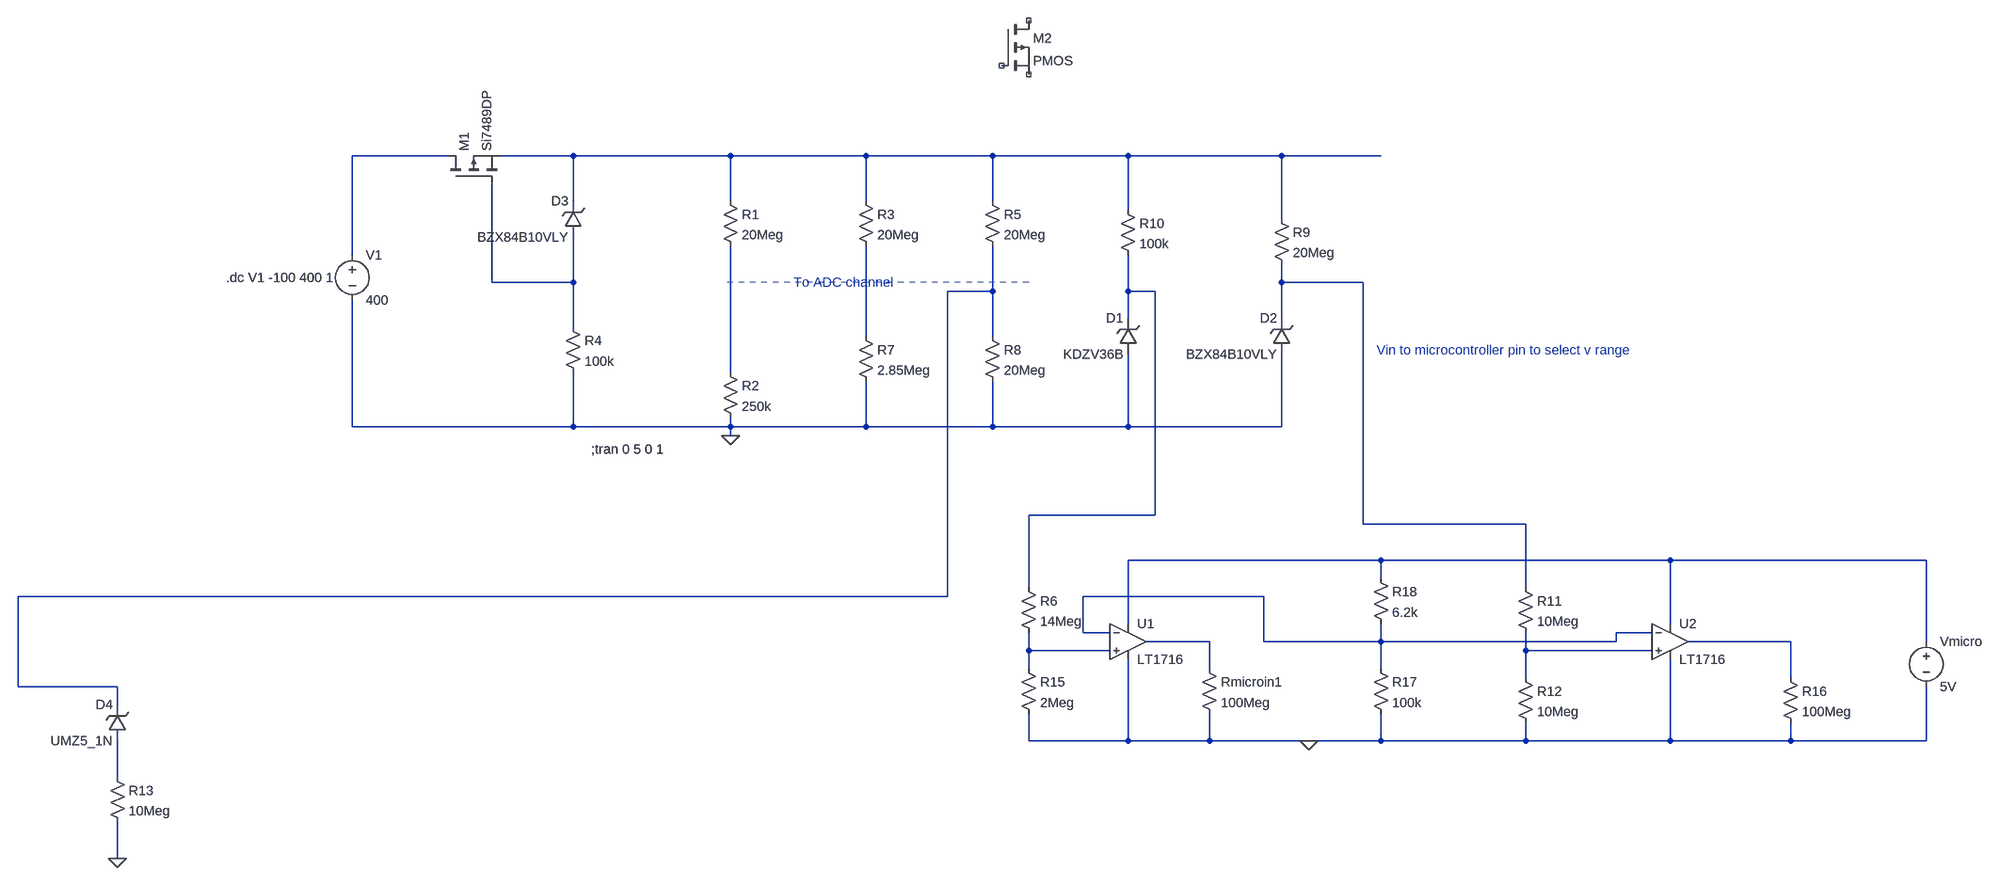
[diagram p0: schematic Voltmeter with range select.asc]
Voltmeter with range select.asc, the LTspice schematic file:
Version 4
SHEET 1 2620 1252
WIRE -288 -48 -480 -48
WIRE -64 -48 -192 -48
WIRE 288 -48 -64 -48
WIRE 528 -48 288 -48
WIRE 752 -48 528 -48
WIRE 992 -48 752 -48
WIRE 1264 -48 992 -48
WIRE 1440 -48 1264 -48
WIRE -64 32 -64 -48
WIRE 288 32 288 -48
WIRE 528 32 528 -48
WIRE 752 32 752 -48
WIRE 992 48 992 -48
WIRE 1264 64 1264 -48
WIRE -480 128 -480 -48
WIRE -208 176 -208 0
WIRE -64 176 -64 96
WIRE -64 176 -208 176
WIRE 1264 176 1264 144
WIRE 1408 176 1264 176
WIRE 752 192 752 112
WIRE 752 192 672 192
WIRE 992 192 992 128
WIRE 1040 192 992 192
WIRE 992 240 992 192
WIRE 1264 240 1264 176
WIRE -64 256 -64 176
WIRE 528 272 528 112
WIRE 752 272 752 192
WIRE 288 336 288 112
WIRE -480 432 -480 208
WIRE -64 432 -64 336
WIRE -64 432 -480 432
WIRE 288 432 288 416
WIRE 288 432 -64 432
WIRE 528 432 528 352
WIRE 528 432 288 432
WIRE 752 432 752 352
WIRE 752 432 528 432
WIRE 992 432 992 304
WIRE 992 432 752 432
WIRE 1264 432 1264 304
WIRE 1264 432 992 432
WIRE 288 448 288 432
WIRE 1040 624 1040 192
WIRE 1040 624 816 624
WIRE 1408 640 1408 176
WIRE 1696 640 1408 640
WIRE 1440 704 992 704
WIRE 1952 704 1440 704
WIRE 2512 704 1952 704
WIRE 1440 736 1440 704
WIRE 816 752 816 624
WIRE 1696 752 1696 640
WIRE 672 768 672 192
WIRE 672 768 -1072 768
WIRE 1232 768 912 768
WIRE 992 816 992 704
WIRE 1952 816 1952 704
WIRE 912 832 912 768
WIRE 960 832 912 832
WIRE 1920 832 1856 832
WIRE 1136 848 1024 848
WIRE 1232 848 1232 768
WIRE 1440 848 1440 816
WIRE 1440 848 1232 848
WIRE 1856 848 1856 832
WIRE 1856 848 1440 848
WIRE 2192 848 1984 848
WIRE 2512 848 2512 704
WIRE 816 864 816 832
WIRE 960 864 816 864
WIRE 1696 864 1696 832
WIRE 1920 864 1696 864
WIRE 816 896 816 864
WIRE 1136 896 1136 848
WIRE 1440 896 1440 848
WIRE 1696 912 1696 864
WIRE 2192 912 2192 848
WIRE -1072 928 -1072 768
WIRE -896 928 -1072 928
WIRE -896 960 -896 928
WIRE 816 1024 816 976
WIRE 992 1024 992 880
WIRE 992 1024 816 1024
WIRE 1136 1024 1136 976
WIRE 1136 1024 992 1024
WIRE 1312 1024 1136 1024
WIRE 1440 1024 1440 976
WIRE 1440 1024 1312 1024
WIRE 1696 1024 1696 992
WIRE 1696 1024 1440 1024
WIRE 1952 1024 1952 880
WIRE 1952 1024 1696 1024
WIRE 2192 1024 2192 992
WIRE 2192 1024 1952 1024
WIRE 2512 1024 2512 928
WIRE 2512 1024 2192 1024
WIRE -896 1088 -896 1024
WIRE -896 1232 -896 1168
FLAG 288 448 0
FLAG 1312 1024 0
FLAG -896 1232 0
SYMBOL voltage -480 112 R0
WINDOW 123 0 0 Left 0
WINDOW 39 0 0 Left 0
SYMATTR InstName V1
SYMATTR Value 400
SYMBOL res 272 16 R0
SYMATTR InstName R1
SYMATTR Value 20Meg
SYMBOL res 272 320 R0
SYMATTR InstName R2
SYMATTR Value 250k
SYMBOL res 512 16 R0
SYMATTR InstName R3
SYMATTR Value 20Meg
SYMBOL res 736 16 R0
SYMATTR InstName R5
SYMATTR Value 20Meg
SYMBOL res 512 256 R0
SYMATTR InstName R7
SYMATTR Value 2.85Meg
SYMBOL res 736 256 R0
SYMATTR InstName R8
SYMATTR Value 20Meg
SYMBOL zener 1008 304 R180
WINDOW 0 24 64 Left 2
WINDOW 3 24 0 Left 2
SYMATTR InstName D1
SYMATTR Value KDZV36B
SYMBOL zener 1280 304 R180
WINDOW 0 24 64 Left 2
WINDOW 3 24 0 Left 2
SYMATTR InstName D2
SYMATTR Value BZX84B10VLY
SYMBOL res 1248 48 R0
SYMATTR InstName R9
SYMATTR Value 20Meg
SYMBOL res 976 32 R0
SYMATTR InstName R10
SYMATTR Value 100k
SYMBOL pmos 768 -288 R0
SYMATTR InstName M2
SYMBOL voltage 2512 832 R0
WINDOW 123 0 0 Left 0
WINDOW 39 0 0 Left 0
SYMATTR InstName Vmicro
SYMATTR Value 5V
SYMBOL res 800 736 R0
SYMATTR InstName R6
SYMATTR Value 14Meg
SYMBOL res 800 880 R0
SYMATTR InstName R15
SYMATTR Value 2Meg
SYMBOL res 1120 880 R0
SYMATTR InstName Rmicroin1
SYMATTR Value 100Meg
SYMBOL res 1424 880 R0
SYMATTR InstName R17
SYMATTR Value 100k
SYMBOL res 1424 720 R0
SYMATTR InstName R18
SYMATTR Value 6.2k
SYMBOL Comparators\\LT1716 992 848 R0
SYMATTR InstName U1
SYMBOL pmos -288 0 R270
SYMATTR InstName M1
SYMATTR Value Si7489DP
SYMBOL zener -48 96 R180
WINDOW 0 24 64 Left 2
WINDOW 3 24 0 Left 2
SYMATTR InstName D3
SYMATTR Value BZX84B10VLY
SYMBOL res -80 240 R0
SYMATTR InstName R4
SYMATTR Value 100k
SYMBOL res 1680 736 R0
SYMATTR InstName R11
SYMATTR Value 10Meg
SYMBOL res 1680 896 R0
SYMATTR InstName R12
SYMATTR Value 10Meg
SYMBOL Comparators\\LT1716 1952 848 R0
SYMATTR InstName U2
SYMBOL res 2176 896 R0
SYMATTR InstName R16
SYMATTR Value 100Meg
SYMBOL zener -880 1024 R180
WINDOW 0 24 64 Left 2
WINDOW 3 24 0 Left 2
SYMATTR InstName D4
SYMATTR Value UMZ5_1N
SYMBOL res -912 1072 R0
SYMATTR InstName R13
SYMATTR Value 10Meg
TEXT -32 472 Left 2 !;tran 0 5 0 1
TEXT 1432 296 Left 2 ;Vin to microcontroller pin to select v range
TEXT 400 176 Left 2 ;To ADC channel
TEXT -704 168 Left 2 !.dc V1 -100 400 1
LINE Normal 816 176 272 176 2

The netlist it stands for:
* Voltmeter with range select.asc
V1 N001 0 400
R1 N002 N008 20Meg
R2 N008 0 250k
R3 N002 N007 20Meg
R5 N002 N005 20Meg
R7 N007 0 2.85Meg
R8 N005 0 20Meg
D1 0 N006 KDZV36B
D2 0 N004 BZX84B10VLY
R9 N002 N004 20Meg
R10 N002 N006 100k
M2 NC_01 NC_02 NC_03 NC_03 PMOS
Vmicro N009 0 5V
R6 N006 N013 14Meg
R15 N013 0 2Meg
Rmicroin1 N011 0 100Meg
R17 N010 0 100k
R18 N009 N010 6.2k
XU1 N013 N010 N009 0 N011 LT1716  ; pins In+ In- V+ V- OUT
M1 N001 N003 N002 N002 Si7489DP
D3 N003 N002 BZX84B10VLY
R4 N003 0 100k
R11 N004 N014 10Meg
R12 N014 0 10Meg
XU2 N014 N010 N009 0 N012 LT1716  ; pins In+ In- V+ V- OUT
R16 N012 0 100Meg
D4 N015 N005 UMZ5_1N
R13 N015 0 10Meg
.model D D
.lib standard.dio
.model NMOS NMOS
.model PMOS PMOS
.lib standard.mos
;tran 0 5 0 1
* Vin to microcontroller pin to select v range
* To ADC channel
.dc V1 -100 400 1
.lib LTC1.lib
.backanno
.end